# EAGLE design jtag-adapter_1.01 (EAGLE 9.6.2)
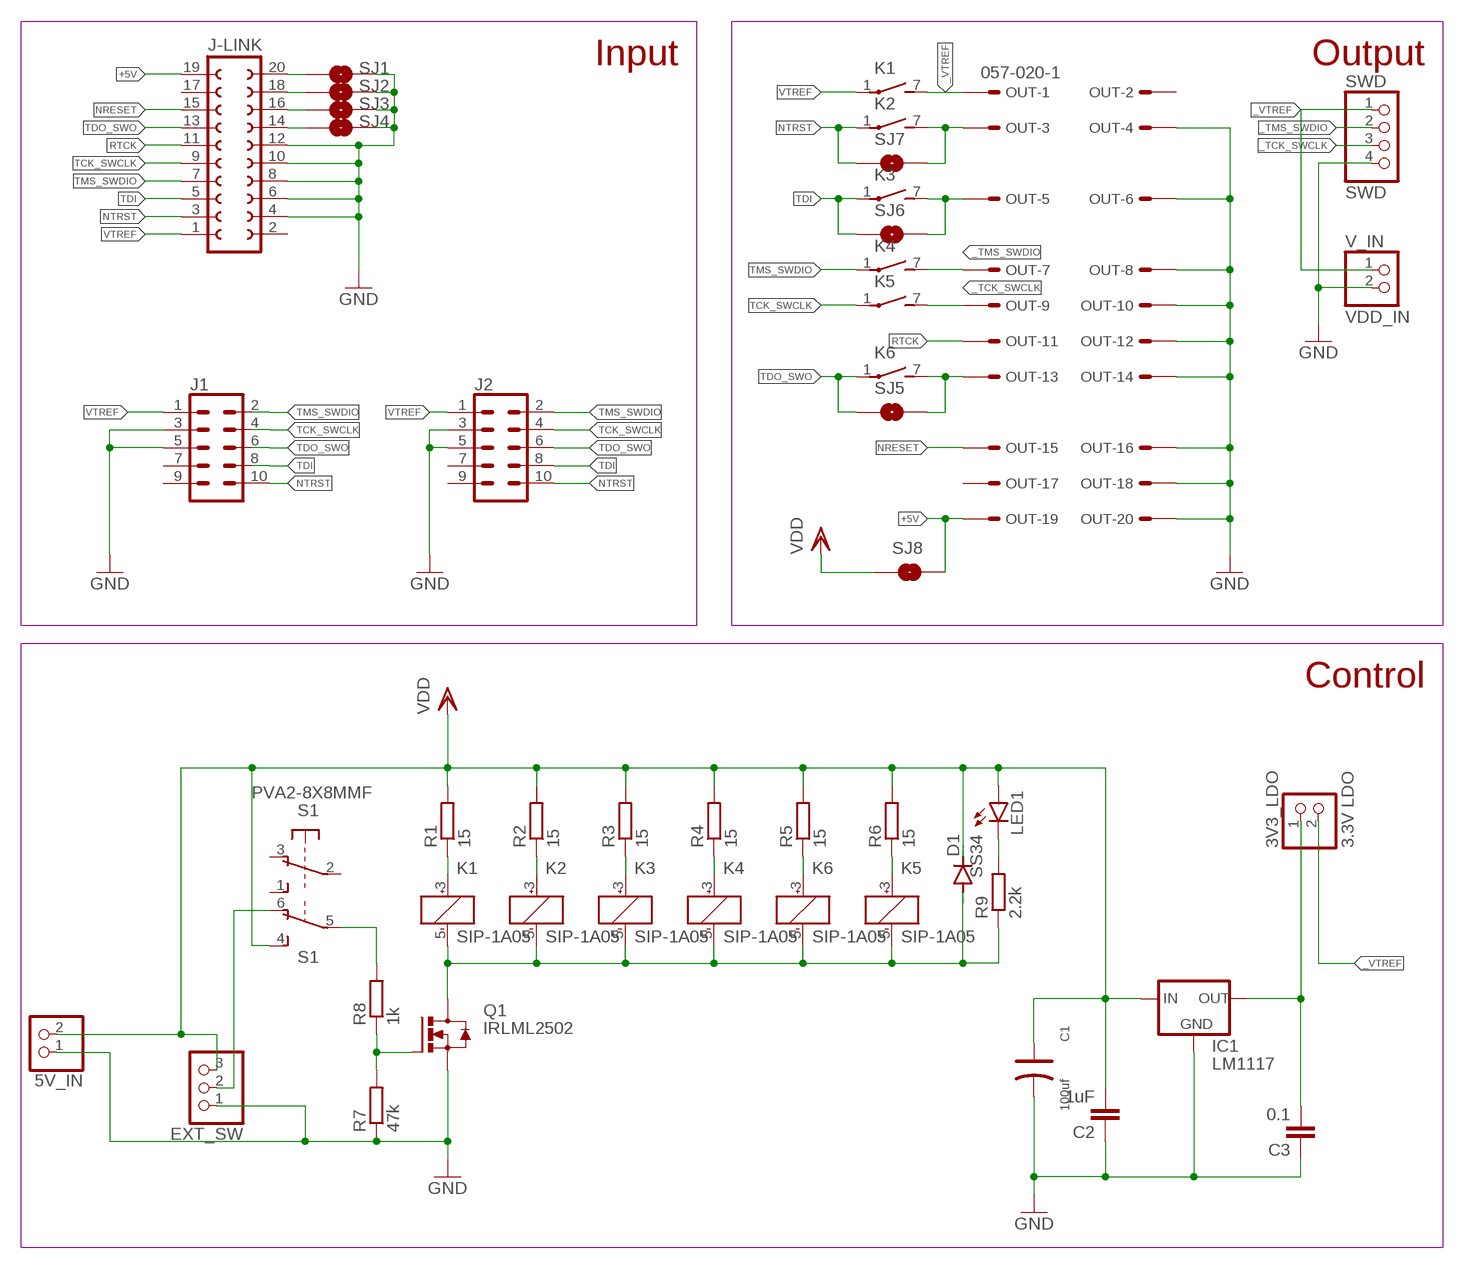
[diagram p0: schematic, sheet 1]

## Parts
3V3_LDO  3.3V LDO  PINHD-1X2  [1X02]
5V_IN  PINHD-1X2  [1X02]
C1  100uf  TANTALUM-SMD-47UF-16V-10%(AVX-B)  [AVX-B]
C2  1uF  C-EUC1206  [C1206]
C3  0.1  C-EUC1206  [C1206]
D1  SS34  DIODE-SMB  [SMB]
EXT_SW  PINHD-1X3  [1X03]
IC1  LM1117  [SOT223]
J1  CONN_05X20.05_IN_PTH_SILK  [2X5_PTH_SILK_.05]
J2  CONN_05X20.05_IN_PTH_SILK  [2X5_PTH_SILK_.05]
J-LINK  FE10-2W  [FE10-2W]
K1  SIP-1A05  REED  [REED]
K2  SIP-1A05  REED  [REED]
K3  SIP-1A05  REED  [REED]
K4  SIP-1A05  REED  [REED]
K5  SIP-1A05  REED  [REED]
K6  SIP-1A05  REED  [REED]
LED1  LEDCHIP-LED0805  [CHIP-LED0805]
OUT  057-020-1  [057-020-1]
Q1  IRLML2502  MOSFET_N_SOT231  [SOT23]
R1  15  R-EU_R0805  [R0805]
R2  15  R-EU_R0805  [R0805]
R3  15  R-EU_R0805  [R0805]
R4  15  R-EU_R0805  [R0805]
R5  15  R-EU_R0805  [R0805]
R6  15  R-EU_R0805  [R0805]
R7  47k  R-EU_R0805  [R0805]
R8  1k  R-EU_R0805  [R0805]
R9  2.2k  R-EU_R0805  [R0805]
S1  PVA2-8X8MMF  [PVA2F]
SJ1  SOLDERJUMPERTRACE  [SJ_2S-TRACE]
SJ2  SOLDERJUMPERTRACE  [SJ_2S-TRACE]
SJ3  SOLDERJUMPERTRACE  [SJ_2S-TRACE]
SJ4  SOLDERJUMPERTRACE  [SJ_2S-TRACE]
SJ5  SOLDERJUMPERTRACE  [SJ_2S-TRACE]
SJ6  SOLDERJUMPERTRACE  [SJ_2S-TRACE]
SJ7  SOLDERJUMPERTRACE  [SJ_2S-TRACE]
SJ8  SOLDERJUMPERTRACE  [SJ_2S-TRACE]
SWD  SWD  PINHD-1X4  [1X04]
V_IN  VDD_IN  PINHD-1X2  [1X02]

## Nets
3V3_OUT: 3V3_LDO.1 C3.2 IC1.2(OUT)
+5V: J-LINK.19 OUT.19 SJ8.2
_TCK_SWCLK: K5.7(2:S) OUT.9 SWD.3
_TMS_SWDIO: K4.7(2:S) OUT.7 SWD.2
_VTREF: 3V3_LDO.2 K1.7(2:S) OUT.1 SWD.1 V_IN.1
GND: 5V_IN.1 C1.- C2.1 C3.1 EXT_SW.1 IC1.1(GND) J1.3 J1.5 J2.3 J2.5 J-LINK.4 J-LINK.6 J-LINK.8 J-LINK.10 J-LINK.12 OUT.4 OUT.6 OUT.8 OUT.10 OUT.12 OUT.14 OUT.16 OUT.18 OUT.20 Q1.2(S) R7.1 SJ1.2 SJ2.2 SJ3.2 SJ4.2 SWD.4 V_IN.2
N$1: LED1.C R9.2
N$2: R8.2 S1.5(2:P)
N$3: K2.7(2:S) OUT.3 SJ7.2
N$4: K3.7(2:S) OUT.5 SJ6.2
N$5: EXT_SW.2 S1.6(2:O)
N$7: K6.7(2:S) OUT.13 SJ5.2
N$8: K1.3(1:+) R1.1
N$10: K2.3(1:+) R2.1
N$11: K3.3(1:+) R3.1
N$12: K4.3(1:+) R4.1
N$13: K6.3(1:+) R5.1
N$14: K5.3(1:+) R6.1
N$15: Q1.1(G) R7.2 R8.1
N$16: D1.A K1.5(1:-) K2.5(1:-) K3.5(1:-) K4.5(1:-) K5.5(1:-) K6.5(1:-) Q1.3(D) R9.1
N$17: J-LINK.14 SJ4.1
N$18: J-LINK.16 SJ3.1
N$19: J-LINK.18 SJ2.1
N$20: J-LINK.20 SJ1.1
NRESET: J-LINK.15 OUT.15
NTRST: J1.10 J2.10 J-LINK.3 K2.1(2:P) SJ7.1
RTCK: J-LINK.11 OUT.11
TCK_SWCLK: J1.4 J2.4 J-LINK.9 K5.1(2:P)
TDI: J1.8 J2.8 J-LINK.5 K3.1(2:P) SJ6.1
TDO_SWO: J1.6 J2.6 J-LINK.13 K6.1(2:P) SJ5.1
TMS_SWDIO: J1.2 J2.2 J-LINK.7 K4.1(2:P)
VDD: 5V_IN.2 C1.+ C2.2 D1.C EXT_SW.3 IC1.3(IN) LED1.A R1.2 R2.2 R3.2 R4.2 R5.2 R6.2 S1.4(2:S) SJ8.1
VTREF: J1.1 J2.1 J-LINK.1 K1.1(2:P)
Unconnected: J1.7 J1.9 J2.7 J2.9 J-LINK.2 J-LINK.17 OUT.2 OUT.17 S1.1(1:S) S1.2(1:P) S1.3(1:O)

## Notes on the sheet
- Input | Output
- Control

## Library data of the parts
3V3_LDO 5V_IN V_IN = pinhead:PINHD-1X2: PIN HEADER
C1 = Seeed-Capacitor:TANTALUM-SMD-47UF-16V-10%(AVX-B): 302020020; MPN: TAJB476K010RNJ; VALUE: 47uf
C2 C3 = rcl:C-EU: CAPACITOR, European symbol; SPICEPREFIX: C
D1 = diode:DIODE-: DIODE
EXT_SW = pinhead:PINHD-1X3: PIN HEADER
IC1 = v-reg-3:LM1117
J1 J2 = SparkFun-Connectors:CONN_05X2: Multi connection point. Often used as Generic Header-pin footprint for 0.1 inch spaced/style header connections For AVR SPI programming port, see special device with nice symbol: "AVR_SPI_PROG_5x2.dev" You can populate with any combo of single row headers, but if you'd like an exact match, check these: 2x5 AVR ICSP Male Header <https://www.sparkfun.com/products/778> (PRT-00778) 2x5 Pin Shrouded Header <https://www.sparkfun.com/products/8506> (PRT-08506) On any of the 0.1 inch spaced packages, you can populate with these: Break Away Headers - Straight <https://www.sparkfun.com/products/116> (PRT-00116) Break Away Male Headers - Right Angle <https://www.sparkfun.com/products/553> (PRT-00553) Female Headers <https://www.sparkfun.com/products/115> (PRT-00115) Break Away Headers - Machine Pin <https://www.sparkfun.com/products/117> (PRT-00117) Break Away Female Headers - Swiss Machine Pin <https://www.sparkfun.com/products/743> (PRT-00743) Special note: the shrouded connector mates well with our 5x2 ribbon cables: 2x5 Pin IDC Ribbon Cable <https://www.sparkfun.com/products/8535> (PRT-08535)
J-LINK = con-lsta:FE10-2W: FEMALE HEADER; OC_FARNELL: unknown; OC_NEWARK: unknown
K1-K6 = my_lbr:REED: RELAY reed, 1 x norm. open with polarity, grid 5.08; OC_FARNELL: unknown; OC_NEWARK: unknown
LED1 = led:LED: LED OSRAM: - CHIPLED LG R971, LG N971, LY N971, LG Q971, LY Q971, LO R971, LY R971 LH N974, LH R974 LS Q976, LO Q976, LY Q976 LO Q996 - Hyper CHIPLED LW Q18S LB Q993, LB Q99A, LB R99A - SideLED LS A670, LO A670, LY A670, LG A670, LP A670 LB A673, LV A673, LT A673, LW A673 LH A674 LY A675 LS A676, LA A676, LO A676, LY A676, LW A676 LS A679, LY A679, LG A679 - Hyper Micro SIDELED® LS Y876, LA Y876, LO Y876, LY Y876 LT Y87S - SmartLED LW L88C, LW L88S LB L89C, LB L89S, LG L890 LS L89K, LO L89K, LY L89K LS L896, LA L896, LO L896, LY L896 - TOPLED LS T670, LO T670, LY T670, LG T670, LP T670 LSG T670, LSP T670, LSY T670, LOP T670, LYG T670 LG T671, LOG T671, LSG T671 LB T673, LV T673, LT T673, LW T673 LH T674 LS T676, LA T676, LO T676, LY T676, LB T676, LH T676, LSB T676, LW T676 LB T67C, LV T67C, LT T67C, LS T67K, LO T67K, LY T67K, LW E67C LS E67B, LA E67B, LO E67B, LY E67B, LB E67C, LV E67C, LT E67C LW T67C LS T679, LY T679, LG T679 LS T770, LO T770, LY T770, LG T770, LP T770 LB T773, LV T773, LT T773, LW T773 LH T774 LS E675, LA E675, LY E675, LS T675 LS T776, LA T776, LO T776, LY T776, LB T776 LHGB T686 LT T68C, LB T68C - Hyper Mini TOPLED® LB M676 - Mini TOPLED Santana® LG M470 LS M47K, LO M47K, LY M47K Source: http://www.osram.convergy.de LUXEON: - LUMILED® LXK2-PW12-R00, LXK2-PW12-S00, LXK2-PW14-U00, LXK2-PW14-V00 LXK2-PM12-R00, LXK2-PM12-S00, LXK2-PM14-U00 LXK2-PE12-Q00, LXK2-PE12-R00, LXK2-PE12-S00, LXK2-PE14-T00, LXK2-PE14-U00 LXK2-PB12-K00, LXK2-PB12-L00, LXK2-PB12-M00, LXK2-PB14-N00, LXK2-PB14-P00, LXK2-PB14-Q00 LXK2-PR12-L00, LXK2-PR12-M00, LXK2-PR14-Q00, LXK2-PR14-R00 LXK2-PD12-Q00, LXK2-PD12-R00, LXK2-PD12-S00 LXK2-PH12-R00, LXK2-PH12-S00 LXK2-PL12-P00, LXK2-PL12-Q00, LXK2-PL12-R00 Source: www.luxeon.com KINGBRIGHT: KA-3528ASYC Source: www.kingbright.com
OUT = con-panduit:057-020-: CONNECTOR 20-pin series 057 contact pc board low profile headers; OC_FARNELL: unknown; OC_NEWARK: unknown
Q1 = m-pad-2.1:MOSFET_N_SOT23: n channel mosfets in the sot-23 package standard pinout ie. fairchildsemi.com: FDN327N FDN335N FDN337N FDN372S NDS355AN etc. ie fairchild at digikey: FDV303N NDS351N NDS355N etc.
R1-R9 = rcl:R-EU_: RESISTOR, European symbol; SPICEPREFIX: R
S1 = my_lbr:PVA2-8X8MM: 8x8MM switch
SJ1-SJ8 = SparkFun:SOLDERJUMPER: Solder Jumper Standard SMD solder jumper. Used to automate production. Two varients : Normally Open and Normally Closed are the same, but have different paste layers. NC will have a large amount of paste and should jumper during reflow.
SWD = pinhead:PINHD-1X4: PIN HEADER

## Board
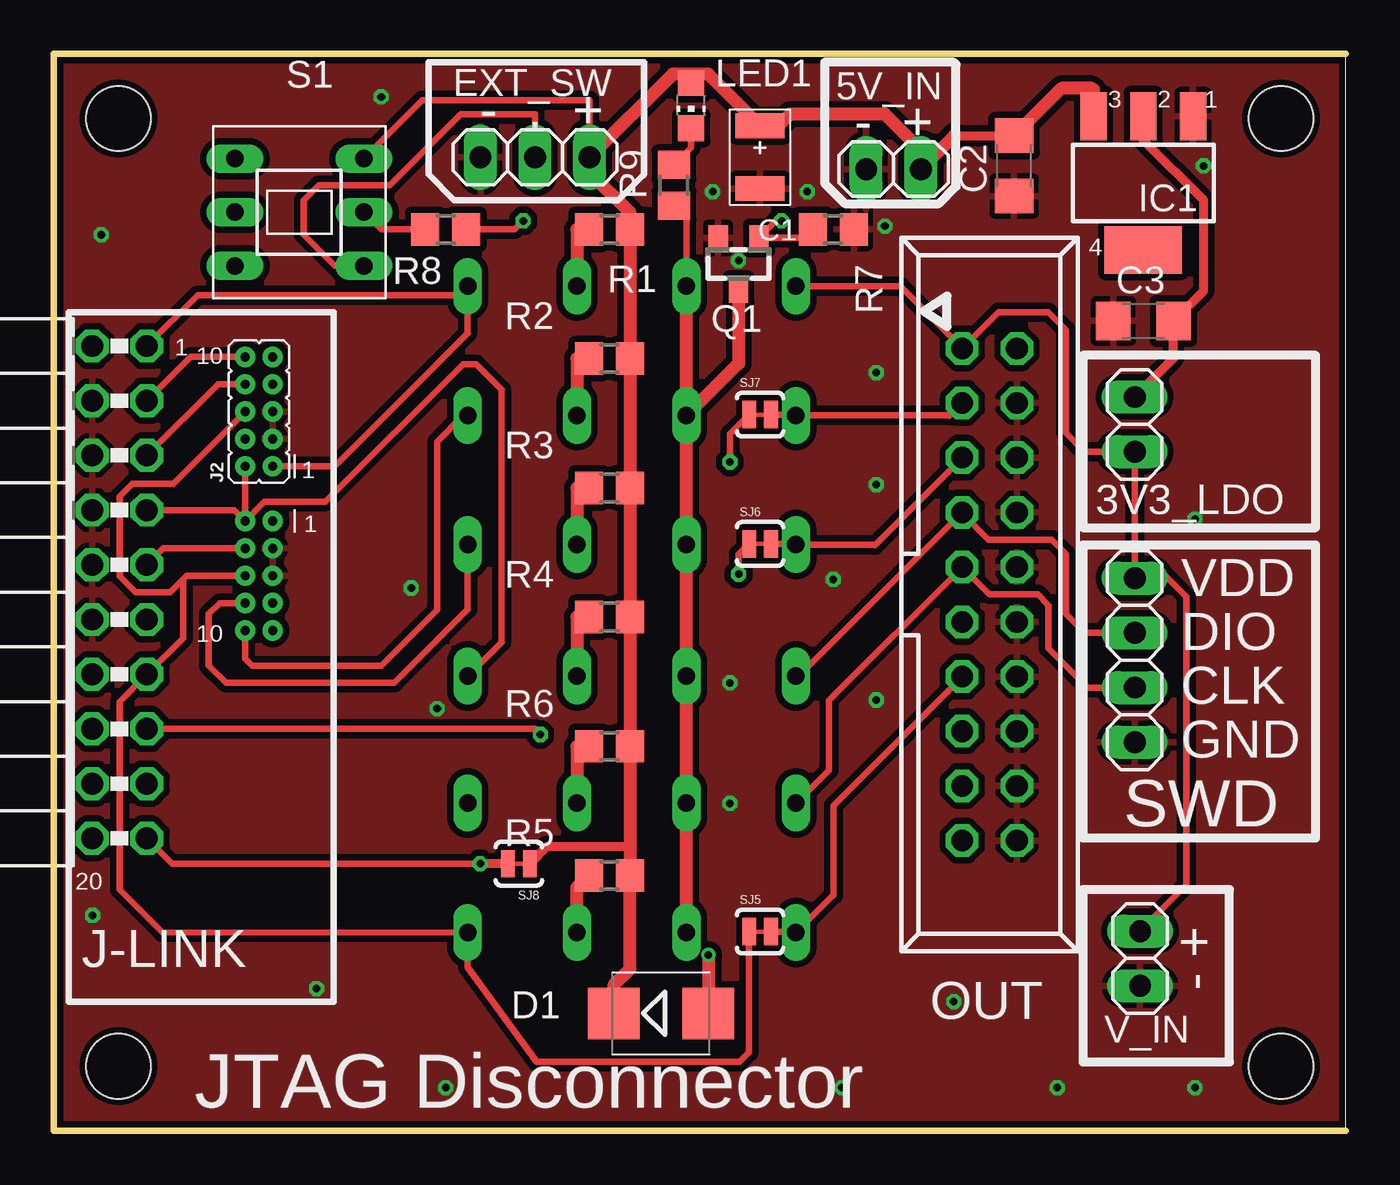
[diagram p1: board, top side]
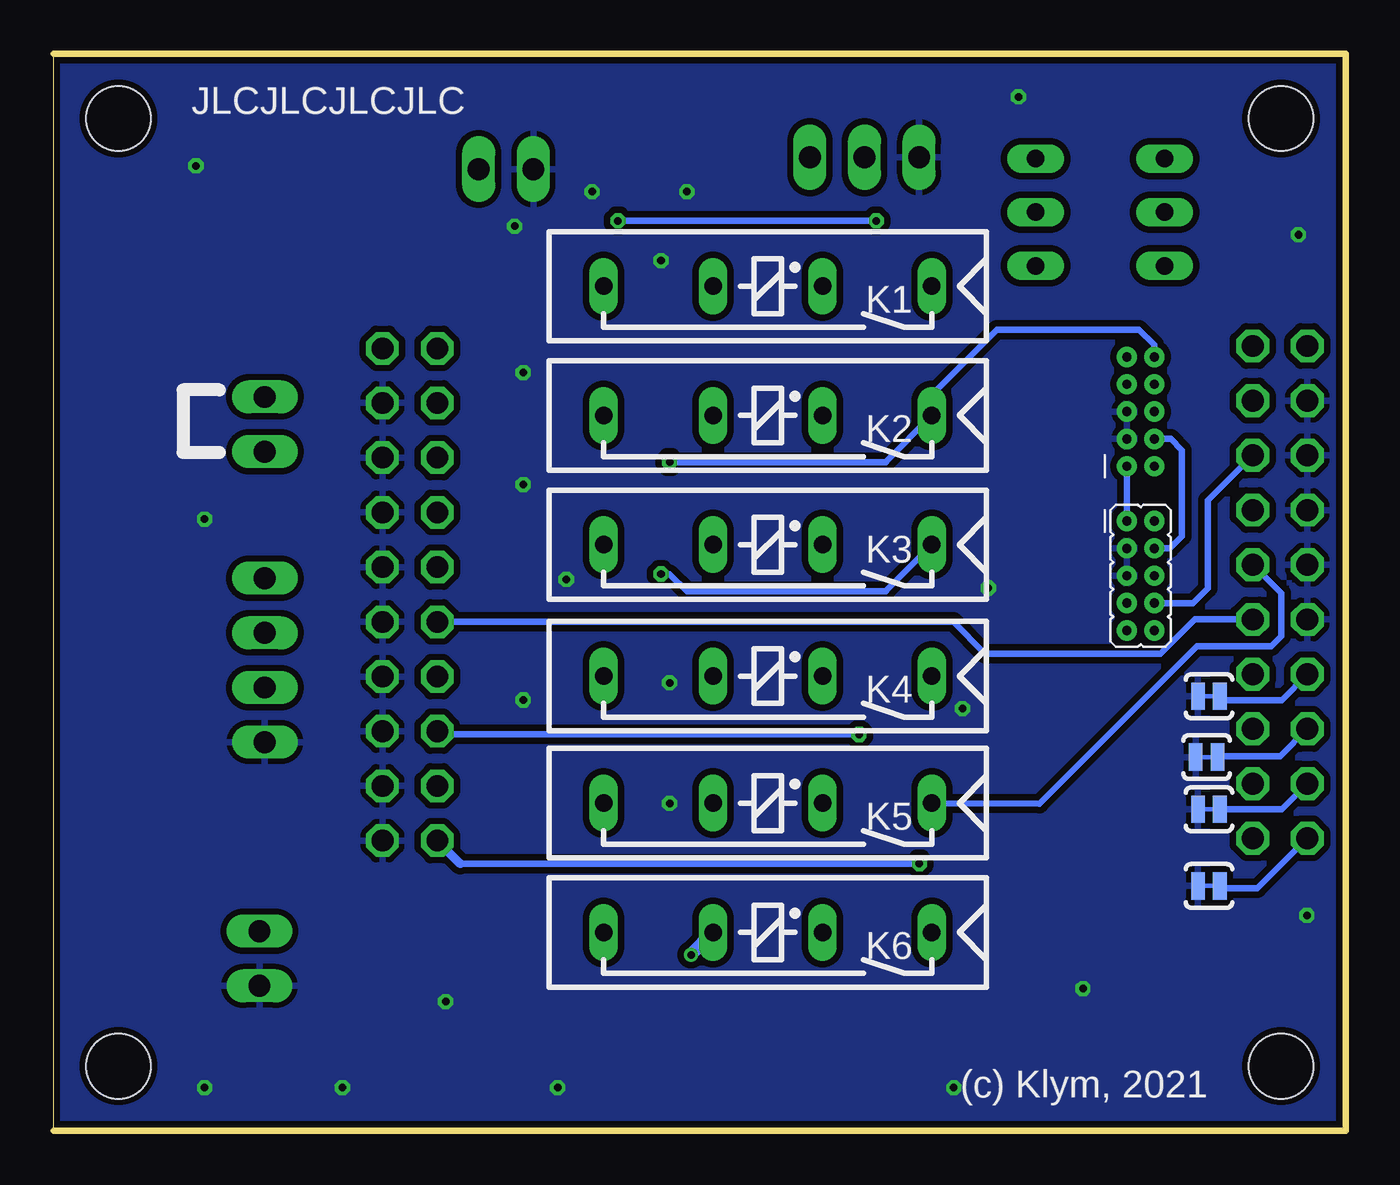
[diagram p2: board, bottom side, seen from below]

Size 60 x 50 mm. Coordinates in mm from the lower left corner, seen from the top.
Outline: 0,0 60,0 60,50 0,50 0,0
Copper layers (1*16): Top 0.035mm / dielectric 1.5mm / Bottom 0.035mm
Design rules "seeed-studio-2-layer": minimum track width 6mil, minimum drill 12mil, track to track 6mil, track to pad 6mil, pad to pad 6mil, via to via 6mil, smd to smd 0mil, copper to edge 10mil, drill to drill 10mil, minimum pad ring 10mil, minimum via ring 6mil, stop-mask expansion 2mil, vias tented up to drill 100mil, thermal gap 10mil
Holes 3 mm at 3,3 3,47 57,3 57,47

### Footprints (pad centres in the part's own frame; a part is rotated, then mirrored left to right if it is on the bottom)
1X02 = drill 1.016 long: 1 -1.27,0; 2 1.27,0
AVX-B = smd 1.143 x 2.286: + -1.46,0; - 1.46,0
C1206 = smd 1.6 x 1.8: 1 -1.4,0; 2 1.4,0
SMB = smd 2.4 x 2.4: A 2.2,0; C -2.2,0
1X03 = drill 1.016 long: 1 -2.54,0; 2 0,0; 3 2.54,0
SOT223 = smd 1.219 x 2.235: 1 -2.311,-3.099; 2 0,-3.099; 3 2.311,-3.099 | smd 3.6 x 2.2: 4 0,3.099
2X5_PTH_SILK_.05 = drill 0.432: 1 0,0; 2 0,1.27; 3 1.27,0; 4 1.27,1.27; 5 2.54,0; 6 2.54,1.27; 7 3.81,0; 8 3.81,1.27; 9 5.08,0; 10 5.08,1.27
FE10-2W = drill 1.016 octagon: 1 -11.43,1.27; 2 -11.43,-1.27; 3 -8.89,1.27; 4 -8.89,-1.27; 5 -6.35,1.27; 6 -6.35,-1.27; 7 -3.81,1.27; 8 -3.81,-1.27; 9 -1.27,1.27; 10 -1.27,-1.27; 11 1.27,1.27; 12 1.27,-1.27; 13 3.81,1.27; 14 3.81,-1.27; 15 6.35,1.27; 16 6.35,-1.27; 17 8.89,1.27; 18 8.89,-1.27; 19 11.43,1.27; 20 11.43,-1.27
REED = drill 0.813 long: 1 -17.78,2.54; 3 -12.7,2.54; 5 -7.62,2.54; 7 -2.54,2.54
CHIP-LED0805 = smd 1.2 x 1.2: A 0,-1.05; C 0,1.05
057-020-1 = drill 1 octagon: 1 -11.43,-1.27; 2 -11.43,1.27; 3 -8.89,-1.27; 4 -8.89,1.27; 5 -6.35,-1.27; 6 -6.35,1.27; 7 -3.81,-1.27; 8 -3.81,1.27; 9 -1.27,-1.27; 10 -1.27,1.27; 11 1.27,-1.27; 12 1.27,1.27; 13 3.81,-1.27; 14 3.81,1.27; 15 6.35,-1.27; 16 6.35,1.27; 17 8.89,-1.27; 18 8.89,1.27; 19 11.43,-1.27; 20 11.43,1.27
SOT23 = smd 0.9 x 1.2: 1 -0.95,-1.2; 2 0.95,-1.2; 3 0,1.2
R0805 = smd 1.3 x 1.5: 1 -0.95,0; 2 0.95,0
PVA2F = drill 0.813 long: 1 -2.997,2.489; 2 -2.997,0; 3 -2.997,-2.489; 4 2.997,2.489; 5 2.997,0; 6 2.997,-2.489
SJ_2S-TRACE = smd 0.635 x 1.27: 1 -0.508,0; 2 0.508,0
1X04 = drill 1.016 long: 1 -3.81,0; 2 -1.27,0; 3 1.27,0; 4 3.81,0

### Placement (x,y rotation side)
3V3_LDO  50.2,32.8 270 top
5V_IN  39,44.65 0 top
C1  32.8,45.2 270 top
C2  44.6,44.8 90 top
C3  50.6,37.6 0 top
D1  28.2,5.45 0 top
EXT_SW  22.35,45.2 0 top
IC1  50.6,44 180 top
J1  10.16,28.31 270 bottom
J2  10.16,30.85 90 top
J-LINK  3.05,25.01 270 top
K1  37,41.75 180 bottom
K2  37,35.75 180 bottom
K3  37,29.75 180 bottom
K4  37,23.65 180 bottom
K5  37,17.75 180 bottom
K6  37,11.75 180 bottom
LED1  29.6,47.6 180 top
OUT  43.46,24.9 270 top
Q1  31.8,40.25 180 top
R1  25.8,41.85 0 top
R2  25.8,35.85 0 top
R3  25.8,29.85 0 top
R4  25.8,23.85 0 top
R5  25.8,11.85 0 top
R6  25.8,17.85 0 top
R7  36.2,41.85 180 top
R8  18.2,41.85 180 top
R9  28.8,43.9 90 top
S1  11.4,42.65 0 top
SJ1  6.35,11.37 180 bottom
SJ2  6.35,14.93 180 bottom
SJ3  6.46,17.35 180 bottom
SJ4  6.35,20.18 180 bottom
SJ5  32.8,9.25 0 top
SJ6  32.8,27.25 0 top
SJ7  32.8,33.25 0 top
SJ8  21.6,12.4 180 top
SWD  50.2,21.85 270 top
V_IN  50.45,8 270 top

### Tracks (layer width: path | path; a pad name or v marks a point on that pad's centre or on a via)
3V3_OUT
  Top 0.406: 3V3_LDO.1 52,35.87 C3.2 53.4,39 53.4,43.2 50.6,46 IC1.2
+5V  (via drill 0.35 pad 0.7)
  Top 0.305: J-LINK.19 5.5,12.4 v19.8,12.4
  Top 0.406: SJ8.2 v19.8,12.4
  Bottom 0.305: v19.8,12.4 41.12,12.4
  Bottom 0.406: 41.12,12.4 OUT.19
_TCK_SWCLK
  Top 0.305: SWD.3 48.02,20.58 46.2,22.4 46.2,24.4 45.7,24.9 43.46,24.9 OUT.9 36,19.98 36,16.75 K5.7
_TMS_SWDIO
  Top 0.305: SWD.2 47.88,23.12 47,24 47,26.8 46.35,27.45 43.4,27.45 42.19,28.66 OUT.7 34.59,21.11 K4.7
_VTREF
  Top 0.305: SWD.1 50.2,26 | 50.2,26 3V3_LDO.2 47.87,31.53 47,32.4 47,37.2 46.2,38 43.86,38 OUT.1 39.31,39.21 K1.7 | V_IN.1 52.6,11.42 52.6,24.8 51.4,26 50.2,26
GND  (via drill 0.35 pad 0.7)
  other vias: 16.6,25.2 53.4,44.8 53,28.4 53,2 46.6,2 36.6,2 41.8,6 18.2,2 12.2,6.6 1.8,10 31.8,40.4 30.6,43.6 35,43.6 38.6,42 38.2,35.2 38.2,30 36.2,25.6 38.2,20 31.4,20.8 17.8,19.6 31.4,15.2 2.2,41.6 15.2,48
  pour Bottom (isolate 0.3): -4.4,53.85 67.4,53.85 67.4,-2.8 -4.4,-2.8
  pour Top (isolate 0.3): -2,52.65 64,52.65 64,-1.2 -2,-1.2
N$1
  Top 0.305: LED1.C 29.6,45.65 R9.2
N$2
  Top 0.305: R8.2 15.2,41.85 S1.5
N$3
  Top 0.305: OUT.3 41.59,33.19 41.57,33.21 K2.7 34.42,33.25 SJ7.2
N$4
  Top 0.305: OUT.5 38.13,27.19 38.11,27.21 K3.7 34.42,27.25 SJ6.2
N$5
  Top 0.305: EXT_SW.2 22.35,47.2 18.9,47.2 15.6,43.9 12.3,43.9 11.6,43.2 11.6,41.6 13.04,40.16 S1.6
N$7
  Top 0.305: OUT.13 36.2,15.1 36.2,10.93 36.18,10.93 K6.7 34.42,9.25 SJ5.2
N$8
  Top 0.61: R1.1 24.3,41.85 K1.3
N$10
  Top 0.61: R2.1 24.3,35.85 K2.3
N$11
  Top 0.61: R3.1 24.3,29.85 K3.3
N$12
  Top 0.61: R4.1 24.3,23.85 K4.3
N$13
  Top 0.61: K6.3 24.3,11.3 R5.1
N$14
  Top 0.61: R6.1 24.3,17.85 K5.3
N$15  (via drill 0.35 pad 0.7)
  Top 0.305: R7.2 34.85,41.45 Q1.1 33.55,42.25 v33.8,42.25 | R8.1 21.4,41.85 v21.8,42.25
  Bottom 0.305: v33.8,42.25 v21.8,42.25
N$16  (via drill 0.35)
  Top 0.305: R9.1 29.38,42.37 K1.5
  Top 0.61: K6.5 K5.5 K4.5 K3.5 K2.5 | K2.5 K1.5 | v30.4,8.17 D1.A | Q1.3 31.8,35.63 K2.5
  Bottom 0.61: K6.5 v30.4,8.17
N$17
  Bottom 0.305: SJ4.1 5.67,20 2.98,20 J-LINK.14
N$18
  Bottom 0.305: SJ3.1 5.9,17.4 3.04,17.4 J-LINK.16
N$19
  Bottom 0.305: SJ2.1 2.97,14.93 J-LINK.18
N$20
  Bottom 0.305: J-LINK.20 4.11,11.25 5.72,11.25 SJ1.1
NRESET  (via drill 0.35 pad 0.7)
  Top 0.305: J-LINK.15 22.34,18.66 v22.6,18.4
  Bottom 0.305: v22.6,18.4 42.04,18.4
  Bottom 0.406: 42.04,18.4 OUT.15
NTRST  (via drill 0.35 pad 0.7)
  Top 0.305: SJ7.1 31.4,32.36 v31.4,31.05 | J1.10 8.89,21.91 9.2,21.6 15.2,21.6 17.8,24.2 17.8,32 19.01,33.21 K2.1 | J-LINK.3 6.35,35.93 J2.10
  Bottom 0.305: v31.4,31.05 21.36,31.05 21.36,31.07 K2.1 19.22,34.18 16.2,37.2 9.6,37.2 8.89,36.49 J2.10
RTCK
  Bottom 0.305: J-LINK.11 7.01,23.74 8.6,22.15 16.75,22.15 18.23,23.63 OUT.11
TCK_SWCLK
  Top 0.305: J-LINK.9 5.08,27.04 J1.4
  Bottom 0.305: J-LINK.9 3,24.96 3,22.95 3.45,22.5 6.91,22.5 14.22,15.19 K5.1 | J1.4 8.16,27.04 7.6,27.6 7.6,31.6 8.12,32.12 J2.4
TDI  (via drill 0.35 pad 0.7)
  Top 0.305: SJ6.1 31.8,26.76 v31.8,25.85 | J1.8 7.7,24.5 7.2,24 7.2,21.6 8,20.8 15.8,20.8 19.22,24.22 K3.1 | J-LINK.5 7.62,34.66 J2.8
  Bottom 0.305: v31.8,25.85 31.4,25.85 30.6,25.05 21.36,25.05 21.36,25.07 K3.1 | J-LINK.5 6.4,29.28 6.4,25.2 7.1,24.5 J1.8
TDO_SWO
  Top 0.305: SJ5.1 32.29,3.65 31.84,3.2 22.42,3.2 19.22,7.59 K6.1 5.06,9.19 3.05,11.2 3.05,19.93 J-LINK.13 6,22.88 6,25.6 | 6,25.6 6.17,25.77 J1.6 | J2.6 5.55,30.05 3.65,30.05 3.05,29.45 3.05,25.75 3.8,25 5.4,25 6,25.6
TMS_SWDIO
  Top 0.305: J-LINK.7 8.38,28.82 J1.2 | J1.2 9.78,29.2 12.6,29.2 19,35.6 19.6,35.6 20.8,34.4 20.8,22.69 K4.1 | J2.2 J1.2
VDD
  Top 0.305: D1.C 26,6.75 | S1.4 17.11,47.85 24.89,47.85 EXT_SW.3 | LED1.A 29.6,49.06
  Top 0.406: 41.82,46.2 C2.2 | 5V_IN.2 40.27,45.53 | SJ8.1 22.91,13.2 26.75,13.2
  Top 0.61: 26,6.75 26.75,7.5 R5.2 26.75,13.2 R6.2 R4.2 R3.2 R2.2 R1.2 26.75,42.65 24.89,44.51 EXT_SW.3 28.75,49.06 29.6,49.06 30.4,49.06 C1.+ 33.66,46.66 34.2,47.2 38.6,47.2 40.27,45.53 | IC1.3 48.29,48.31 48.2,48.4 46.8,48.4 C2.2 | 5V_IN.2 41.82,46.2
VTREF
  Top 0.305: J-LINK.1 6.68,38.8 18.83,38.8 19.22,39.19 K1.1 19.22,37.02 13.05,30.85 J2.1
  Bottom 0.305: J2.1 J1.1

### Text on the board
tPlace: 1 | 10 | 1 | 1 | 10 | 20
tNames: - . + | - + | VDD | DIO | CLK | GND | - + | JTAG Disconnector
bNames: JLCJLCJLCJLC | (c) Klym, 2021